# EAGLE design untitled (EAGLE 6.1)
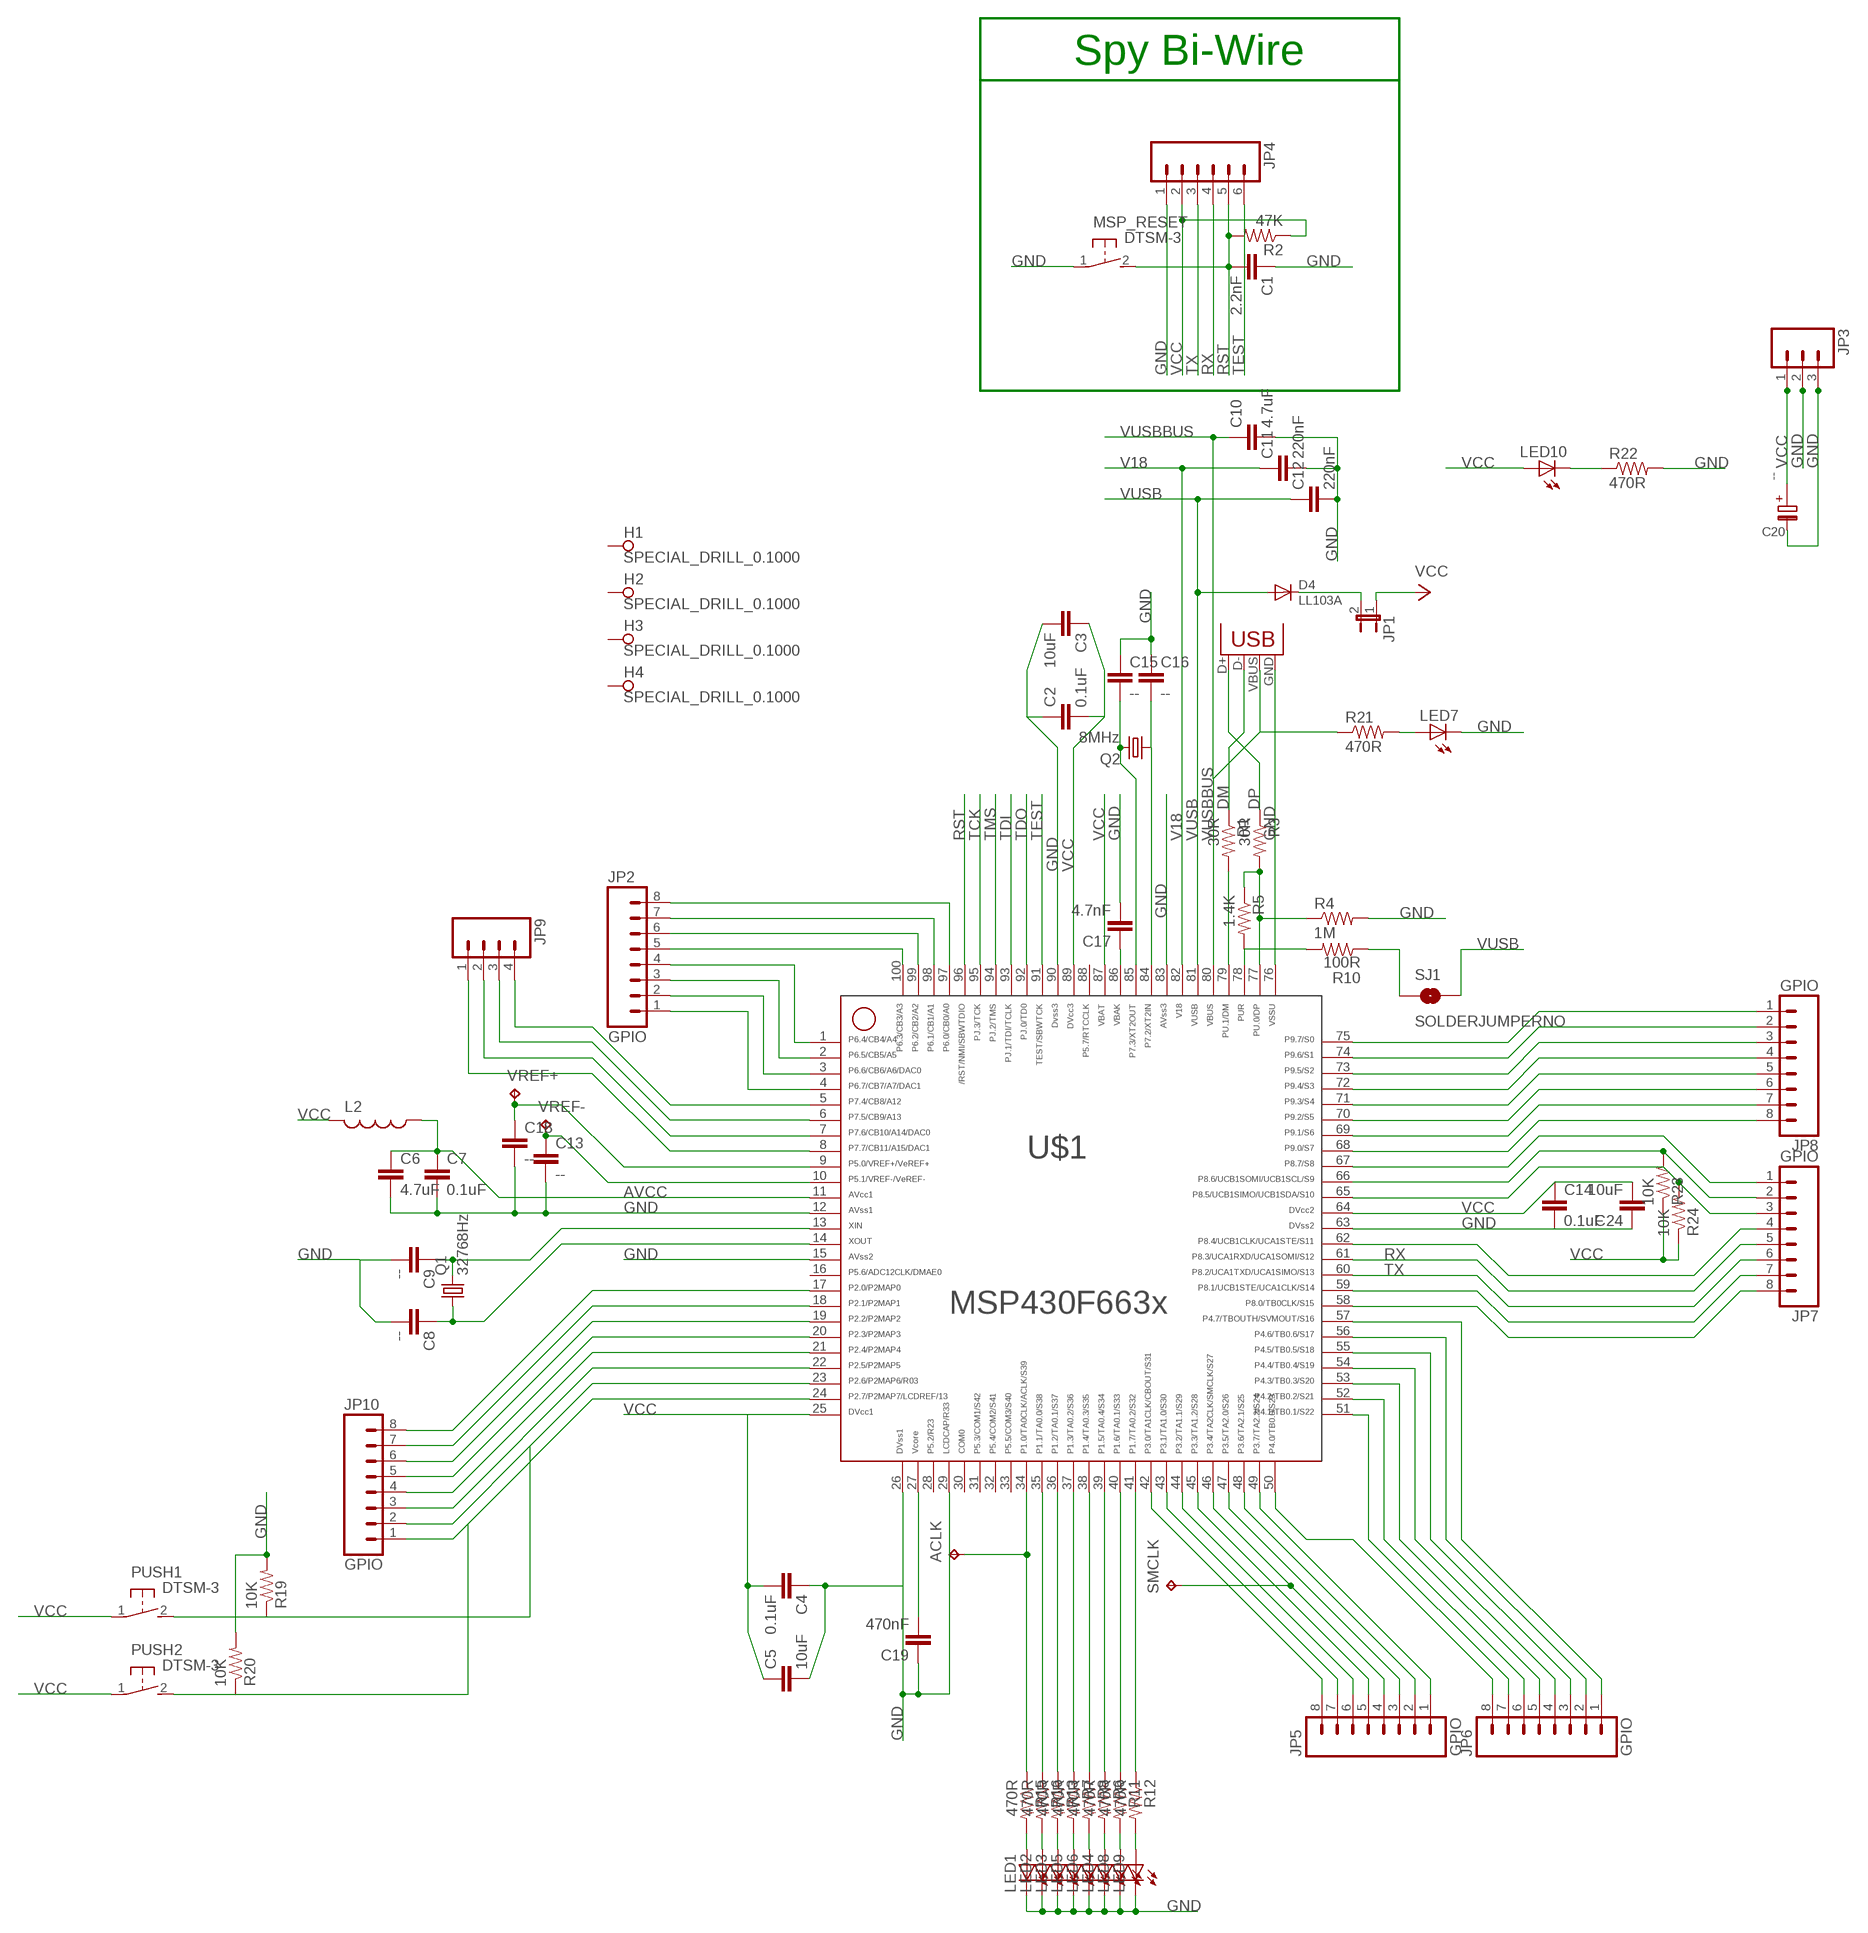
[diagram p0: schematic, sheet 1]

## Parts
ACLK  TPB1,27  [B1,27]
C1  2.2nF  CAP0805  [0805]
C2  0.1uF  CAP0805  [0805]
C3  10uF  CAP0805  [0805]
C4  0.1uF  CAP0805  [0805]
C5  10uF  CAP0805  [0805]
C6  4.7uF  CAP0805  [0805]
C7  0.1uF  CAP0805  [0805]
C8  --  CAP0805  [0805]
C9  --  CAP0805  [0805]
C10  4.7uF  CAP0805  [0805]
C11  220nF  CAP0805  [0805]
C12  220nF  CAP0805  [0805]
C13  --  CAP0805  [0805]
C14  0.1uF  CAP0805  [0805]
C15  --  CAP0805  [0805]
C16  --  CAP0805  [0805]
C17  4.7nF  CAP0805  [0805]
C18  --  CAP0805  [0805]
C19  470nF  CAP0805  [0805]
C20  --  ELKO_1210  [1210ELKO]
C24  10uF  CAP0805  [0805]
D4  LL103A  D  [SOD-80]
H1  SPECIAL_DRILL_0.1000  [PAD_0.1000]
H2  SPECIAL_DRILL_0.1000  [PAD_0.1000]
H3  SPECIAL_DRILL_0.1000  [PAD_0.1000]
H4  SPECIAL_DRILL_0.1000  [PAD_0.1000]
JP1  JP1E  [JP1]
JP2  GPIO  M08  [1X08]
JP3  M03PTH  [1X03]
JP4  M06SIP  [1X06]
JP5  GPIO  M08  [1X08]
JP6  GPIO  M08  [1X08]
JP7  GPIO  M08  [1X08]
JP8  GPIO  M08  [1X08]
JP9  M04PTH  [1X04]
JP10  GPIO  M08  [1X08]
L2  L-USL2012C  [L2012C]
LED1  LEDCHIPLED_0805  [CHIPLED_0805]
LED2  LEDCHIPLED_0805  [CHIPLED_0805]
LED3  LEDCHIPLED_0805  [CHIPLED_0805]
LED4  LEDCHIPLED_0805  [CHIPLED_0805]
LED5  LEDCHIPLED_0805  [CHIPLED_0805]
LED6  LEDCHIPLED_0805  [CHIPLED_0805]
LED7  LEDCHIPLED_0805  [CHIPLED_0805]
LED8  LEDCHIPLED_0805  [CHIPLED_0805]
LED9  LEDCHIPLED_0805  [CHIPLED_0805]
LED10  LEDCHIPLED_0805  [CHIPLED_0805]
MSP_RESET  DTSM-3  [DTSM-3]
PUSH1  DTSM-3  [DTSM-3]
PUSH2  DTSM-3  [DTSM-3]
Q1  32768Hz  CRYSTALTC26H  [TC26H]
Q2  8MHz  CRYSTALHC49U-V  [HC49U-V]
R1  30R  R-US_M0805  [M0805]
R2  47K  R-US_M0805  [M0805]
R3  30R  R-US_M0805  [M0805]
R4  1M  R-US_M0805  [M0805]
R5  1.4K  R-US_M0805  [M0805]
R6  470R  R-US_R0603  [R0603]
R7  470R  R-US_R0603  [R0603]
R8  470R  R-US_R0603  [R0603]
R10  100R  R-US_R0603  [R0603]
R11  470R  R-US_R0603  [R0603]
R12  470R  R-US_R0603  [R0603]
R13  470R  R-US_R0603  [R0603]
R15  470R  R-US_R0603  [R0603]
R16  470R  R-US_R0603  [R0603]
R19  10K  R-US_M0805  [M0805]
R20  10K  R-US_M0805  [M0805]
R21  470R  R-US_R0603  [R0603]
R22  470R  R-US_R0603  [R0603]
R23  10K  R-US_M0805  [M0805]
R24  10K  R-US_M0805  [M0805]
SJ1  SOLDERJUMPERNO  [SJ_2S-NO]
SMCLK  TPB1,27  [B1,27]
U$1  F66XX---PZ100  [PZ100]
VREF+  TPB1,27  [B1,27]
VREF-  TPB1,27  [B1,27]
X1  USBSMD  [USB-MINIB]

## Nets
AVCC: C6.1 C7.1 L2.1 U$1.11
DM: R1.1 X1.D-
DP: R3.1 X1.D+
GND [power]: C1.1 C2.1 C3.2 C4.1 C5.2 C6.2 C7.2 C8.2 C9.2 C10.2 C11.2 C12.2 C13.2 C14.2 C15.1 C16.1 C17.2 C18.2 C19.1 C20.- C24.1 JP3.2 JP3.3 JP4.1 LED1.C LED2.C LED3.C LED4.C LED5.C LED6.C LED7.C LED8.C LED9.C MSP_RESET.1 R4.2 R19.2 R20.2 R22.2 U$1.12 U$1.15 U$1.26 U$1.29 U$1.63 U$1.76 U$1.83 U$1.90 X1.GND
N$1: R1.2 U$1.79
N$3: R3.2 R4.1 R5.1 U$1.77
N$4: R5.2 R10.2 U$1.78
N$5: C9.1 Q1.2 U$1.13
N$6: C8.1 Q1.1 U$1.14
N$7: JP10.7 U$1.18
N$8: R10.1 SJ1.1
N$9: D4.2(K) JP1.2
N$11: R11.1 U$1.40
N$12: C13.1 U$1.10 VREF-.TP
N$13: LED2.A R16.2
N$14: C18.1 U$1.9 VREF+.TP
N$15: R12.1 U$1.41
N$16: C19.2 U$1.27
N$17: R6.1 U$1.39
N$18: R8.1 U$1.38
N$19: R7.1 U$1.37
N$20: JP2.5 U$1.100
N$21: R16.1 U$1.35
N$22: JP2.6 U$1.99
N$23: LED4.A R6.2
N$24: LED3.A R13.2
N$25: JP2.7 U$1.98
N$26: LED5.A R7.2
N$27: LED6.A R8.2
N$28: JP2.8 U$1.97
N$29: JP2.4 U$1.1
N$30: R13.1 U$1.36
N$31: JP2.3 U$1.2
N$32: LED1.A R15.2
N$33: JP2.2 U$1.3
N$34: LED8.A R11.2
N$35: LED7.A R21.2
N$36: ACLK.TP R15.1 U$1.34
N$37: JP10.6 U$1.19
N$38: LED9.A R12.2
N$39: JP2.1 U$1.4
N$40: JP9.4 U$1.5
N$41: JP9.3 U$1.6
N$42: JP9.2 U$1.7
N$43: JP9.1 U$1.8
N$44: JP5.8 U$1.42
N$45: JP5.7 U$1.43
N$46: JP5.6 U$1.44
N$47: JP5.5 U$1.45
N$48: JP5.4 SMCLK.TP U$1.46
N$49: JP5.3 U$1.47
N$50: JP5.2 U$1.48
N$51: JP5.1 U$1.49
N$52: JP6.8 U$1.50
N$53: JP6.7 U$1.51
N$54: JP6.6 U$1.52
N$55: JP6.5 U$1.53
N$56: JP6.4 U$1.54
N$57: JP6.3 U$1.55
N$58: JP6.2 U$1.56
N$59: JP6.1 U$1.57
N$60: C16.2 Q2.1 U$1.84
N$61: C15.2 Q2.2 U$1.85
N$62: C17.1 U$1.86
N$63: LED10.C R22.1
N$64: JP10.5 U$1.20
N$65: JP7.8 U$1.58
N$66: JP7.7 U$1.59
N$68: JP10.2 PUSH1.2 R19.1 U$1.23
N$69: JP7.4 U$1.62
N$70: JP7.3 R24.2 U$1.65
N$71: JP7.2 R23.2 U$1.66
N$72: JP7.1 U$1.67
N$74: JP8.8 U$1.68
N$75: JP8.7 U$1.69
N$76: JP8.6 U$1.70
N$77: JP8.5 U$1.71
N$80: JP10.1 PUSH2.2 R20.1 U$1.24
N$81: JP8.4 U$1.72
N$82: JP8.3 U$1.73
N$83: JP8.2 U$1.74
N$84: JP8.1 U$1.75
N$85: JP10.8 U$1.17
N$86: JP10.4 U$1.21
N$87: JP10.3 U$1.22
RST: C1.2 JP4.5 MSP_RESET.2 R2.2 U$1.96
RX: JP4.4 JP7.5 U$1.61
TCK: U$1.95
TDI: U$1.93
TDO: U$1.92
TEST: JP4.6 U$1.91
TMS: U$1.94
TX: JP4.3 JP7.6 U$1.60
V18: C11.1 U$1.82
VCC: C2.2 C3.1 C4.2 C5.1 C14.1 C20.+ C24.2 JP1.1 JP3.1 JP4.2 L2.2 LED10.A PUSH1.1 PUSH2.1 R2.1 R23.1 R24.1 U$1.25 U$1.64 U$1.87 U$1.89
VUSB: C12.1 D4.1(A) SJ1.2 U$1.81
VUSBBUS: C10.1 R21.1 U$1.80 X1.VBUS
Unconnected: H1.1 H2.1 H3.1 H4.1 U$1.16 U$1.28 U$1.30 U$1.31 U$1.32 U$1.33 U$1.88

## Notes on the sheet
- Spy Bi-Wire

## Library data of the parts
ACLK SMCLK VREF+ VREF- = testpad:TP: Test pad
C1-C19 C24 = SparkFun:CAP: Capacitor Standard 0603 ceramic capacitor, and 0.1" leaded capacitor.
C20 = smd:ELKO_1210
D4 = smd:D
H1-H4 = special-drill:SPECIAL_DRILL_: Special drills
JP1 = jumper:JP1E: JUMPER
JP2 JP5-JP8 JP10 = SparkFunv2:M08: Header 8 Standard 8-pin 0.1" header. Use with straight break away headers (SKU : PRT-00116), right angle break away headers (PRT-00553), swiss pins (PRT-00743), machine pins (PRT-00117), and female headers (PRT-00115).
JP3 = SparkFun:M03: Header 3 Standard 3-pin 0.1" header. Use with straight break away headers (SKU : PRT-00116), right angle break away headers (PRT-00553), swiss pins (PRT-00743), machine pins (PRT-00117), and female headers (PRT-00115). Molex polarized connector foot print use with SKU : PRT-08232 with associated crimp pins and housings.
JP4 = SparkFun:M06: Header 6 Standard 6-pin 0.1" header. Use with straight break away headers (SKU : PRT-00116), right angle break away headers (PRT-00553), swiss pins (PRT-00743), machine pins (PRT-00117), and female headers (PRT-00115). Molex polarized connector foot print use with SKU : PRT-08094 with associated crimp pins and housings. NOTES ON THE VARIANTS LOCK and LOCK_LONGPADS... This footprint was designed to help hold the alignment of a through-hole component (i.e. 6-pin header) while soldering it into place. You may notice that each hole has been shifted either up or down by 0.005 of an inch from it's more standard position (which is a perfectly straight line). This slight alteration caused the pins (the squares in the middle) to touch the edges of the holes. Because they are alternating, it causes a "brace" to hold the component in place. 0.005 has proven to be the perfect amount of "off-center" position when using our standard breakaway headers. Although looks a little odd when you look at the bare footprint, once you have a header in there, the alteration is very hard to notice. Also, if you push a header all the way into place, it is covered up entirely on the bottom side. This idea of altering the position of holes to aid alignment will be further integrated into the Sparkfun Library for other footprints. It can help hold any component with 3 or more connection pins.
JP9 = SparkFun:M04: Header 4 Standard 4-pin 0.1" header. Use with straight break away headers (SKU : PRT-00116), right angle break away headers (PRT-00553), swiss pins (PRT-00743), machine pins (PRT-00117), and female headers (PRT-00115). Molex polarized connector foot print use with SKU : PRT-08231 with associated crimp pins and housings. 1MM SMD Version SKU: PRT-10208
L2 = rcl:L-US: INDUCTOR, American symbol
LED1-LED10 = led:LED: LED OSRAM: - CHIPLED LG R971, LG N971, LY N971, LG Q971, LY Q971, LO R971, LY R971 LH N974, LH R974 LS Q976, LO Q976, LY Q976 LO Q996 - Hyper CHIPLED LW Q18S LB Q993, LB Q99A, LB R99A - SideLED LS A670, LO A670, LY A670, LG A670, LP A670 LB A673, LV A673, LT A673, LW A673 LH A674 LY A675 LS A676, LA A676, LO A676, LY A676, LW A676 LS A679, LY A679, LG A679 - Hyper Micro SIDELED® LS Y876, LA Y876, LO Y876, LY Y876 LT Y87S - SmartLED LW L88C, LW L88S LB L89C, LB L89S, LG L890 LS L89K, LO L89K, LY L89K LS L896, LA L896, LO L896, LY L896 - TOPLED LS T670, LO T670, LY T670, LG T670, LP T670 LSG T670, LSP T670, LSY T670, LOP T670, LYG T670 LG T671, LOG T671, LSG T671 LB T673, LV T673, LT T673, LW T673 LH T674 LS T676, LA T676, LO T676, LY T676, LB T676, LH T676, LSB T676, LW T676 LB T67C, LV T67C, LT T67C, LS T67K, LO T67K, LY T67K, LW E67C LS E67B, LA E67B, LO E67B, LY E67B, LB E67C, LV E67C, LT E67C LW T67C LS T679, LY T679, LG T679 LS T770, LO T770, LY T770, LG T770, LP T770 LB T773, LV T773, LT T773, LW T773 LH T774 LS E675, LA E675, LY E675, LS T675 LS T776, LA T776, LO T776, LY T776, LB T776 LHGB T686 LT T68C, LB T68C - Hyper Mini TOPLED® LB M676 - Mini TOPLED Santana® LG M470 LS M47K, LO M47K, LY M47K Source: http://www.osram.convergy.de LUXEON: - LUMILED® LXK2-PW12-R00, LXK2-PW12-S00, LXK2-PW14-U00, LXK2-PW14-V00 LXK2-PM12-R00, LXK2-PM12-S00, LXK2-PM14-U00 LXK2-PE12-Q00, LXK2-PE12-R00, LXK2-PE12-S00, LXK2-PE14-T00, LXK2-PE14-U00 LXK2-PB12-K00, LXK2-PB12-L00, LXK2-PB12-M00, LXK2-PB14-N00, LXK2-PB14-P00, LXK2-PB14-Q00 LXK2-PR12-L00, LXK2-PR12-M00, LXK2-PR14-Q00, LXK2-PR14-R00 LXK2-PD12-Q00, LXK2-PD12-R00, LXK2-PD12-S00 LXK2-PH12-R00, LXK2-PH12-S00 LXK2-PL12-P00, LXK2-PL12-Q00, LXK2-PL12-R00 Source: www.luxeon.com KINGBRIGHT: KA-3528ASYC Source: www.kingbright.com
MSP_RESET PUSH1 PUSH2 = switch-tact:DTSM-3
Q1 Q2 = crystal:CRYSTAL: CRYSTAL
R1-R5 R19 R20 R23 R24 = resistor:R-US_: RESISTOR, American symbol
R6-R8 R11-R13 R15 R16 R21 R22 = _MSP430:R-US_: RESISTOR, American symbol
R10 = rcl:R-US_: RESISTOR, American symbol
SJ1 = SparkFun:SOLDERJUMPER: Solder Jumper Standard SMD solder jumper. Used to automate production. Two varients : Normally Open and Normally Closed are the same, but have different paste layers. NC will have a large amount of paste and should jumper during reflow.
U$1 = TI_MSP430_v16:F66XX---PZ100: ***MSP430F66XX***PZ64 Rev 1.0 *** 06/2010
X1 = SparkFun:USB: USB Connectors USB-B-PTH is fully proven SKU : PRT-00139 USB-miniB is fully proven SKU : PRT-00587 USB-A-PCB is untested. USB-A-H is throughly reviewed, but untested. Spark Fun Electronics SKU : PRT-00437 USB-B-SMT is throughly reviewed, but untested. Needs silkscreen touching up. USB-A-S has not been used/tested USB-MB-H has not been used/tested

## Net classes
0 default: width 0.178 mm, drill 0.381 mm, clearance 0.178 mm
1 power: width 0.254 mm, drill 0.305 mm, clearance 0.152 mm

## Board
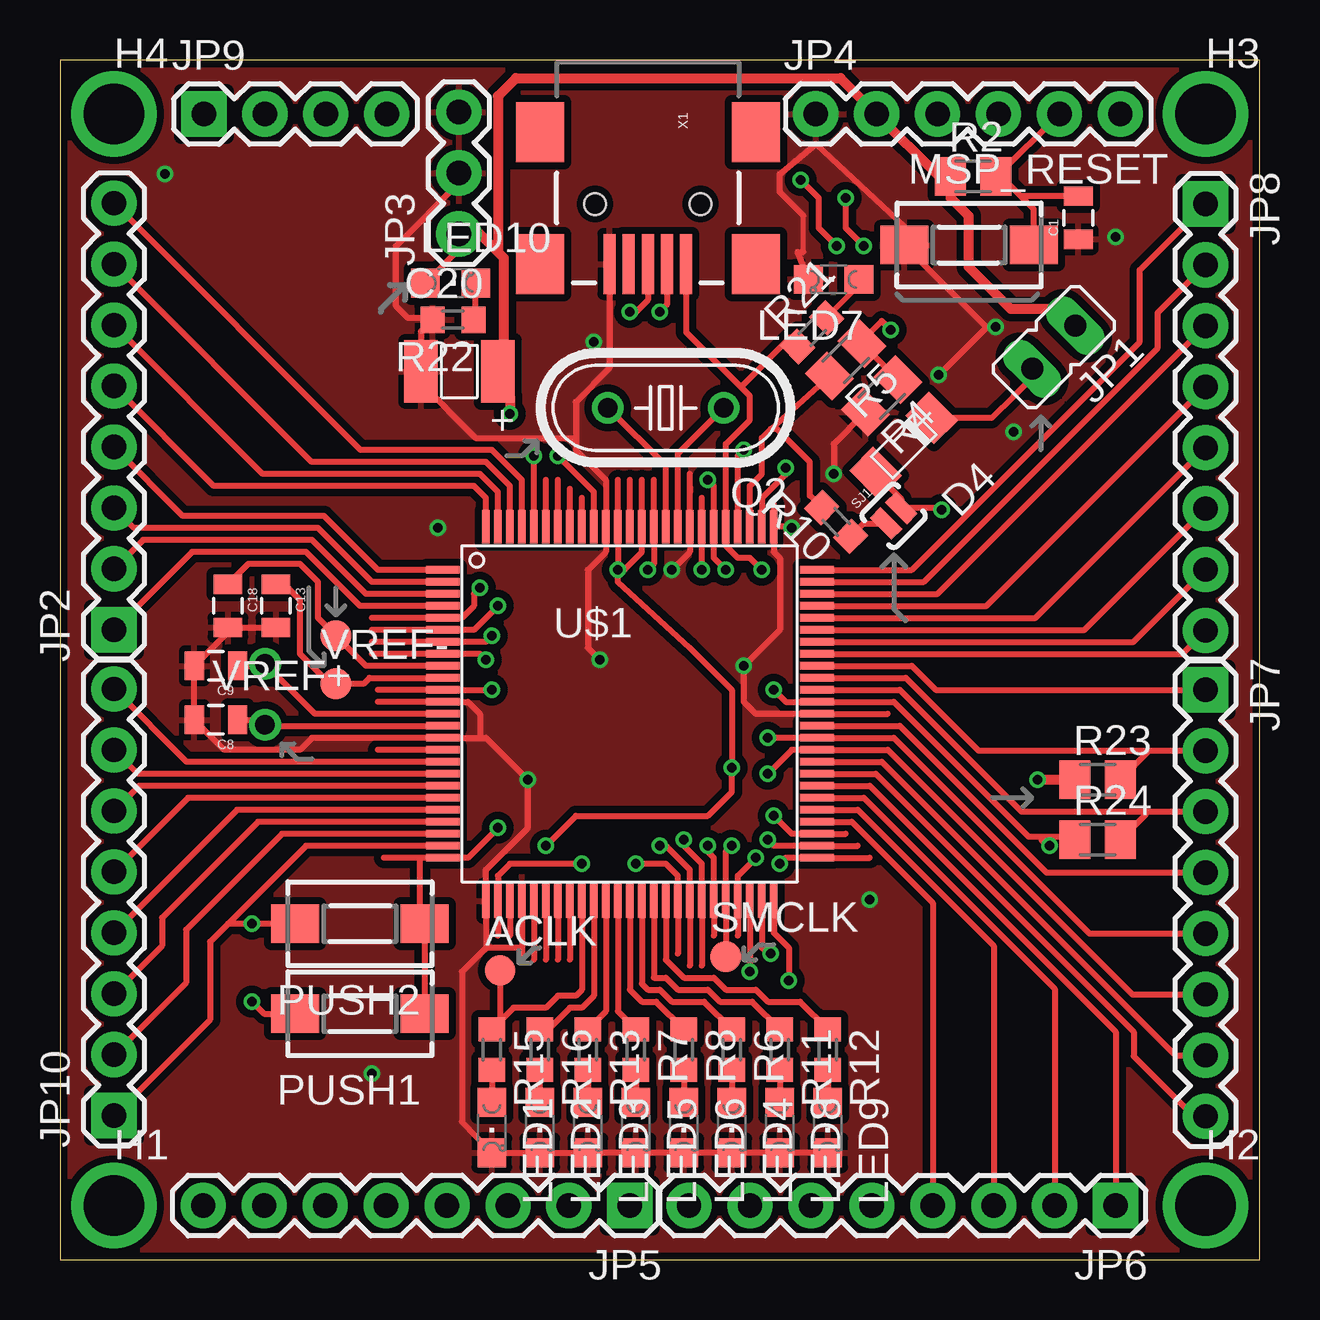
[diagram p1: board, top side]
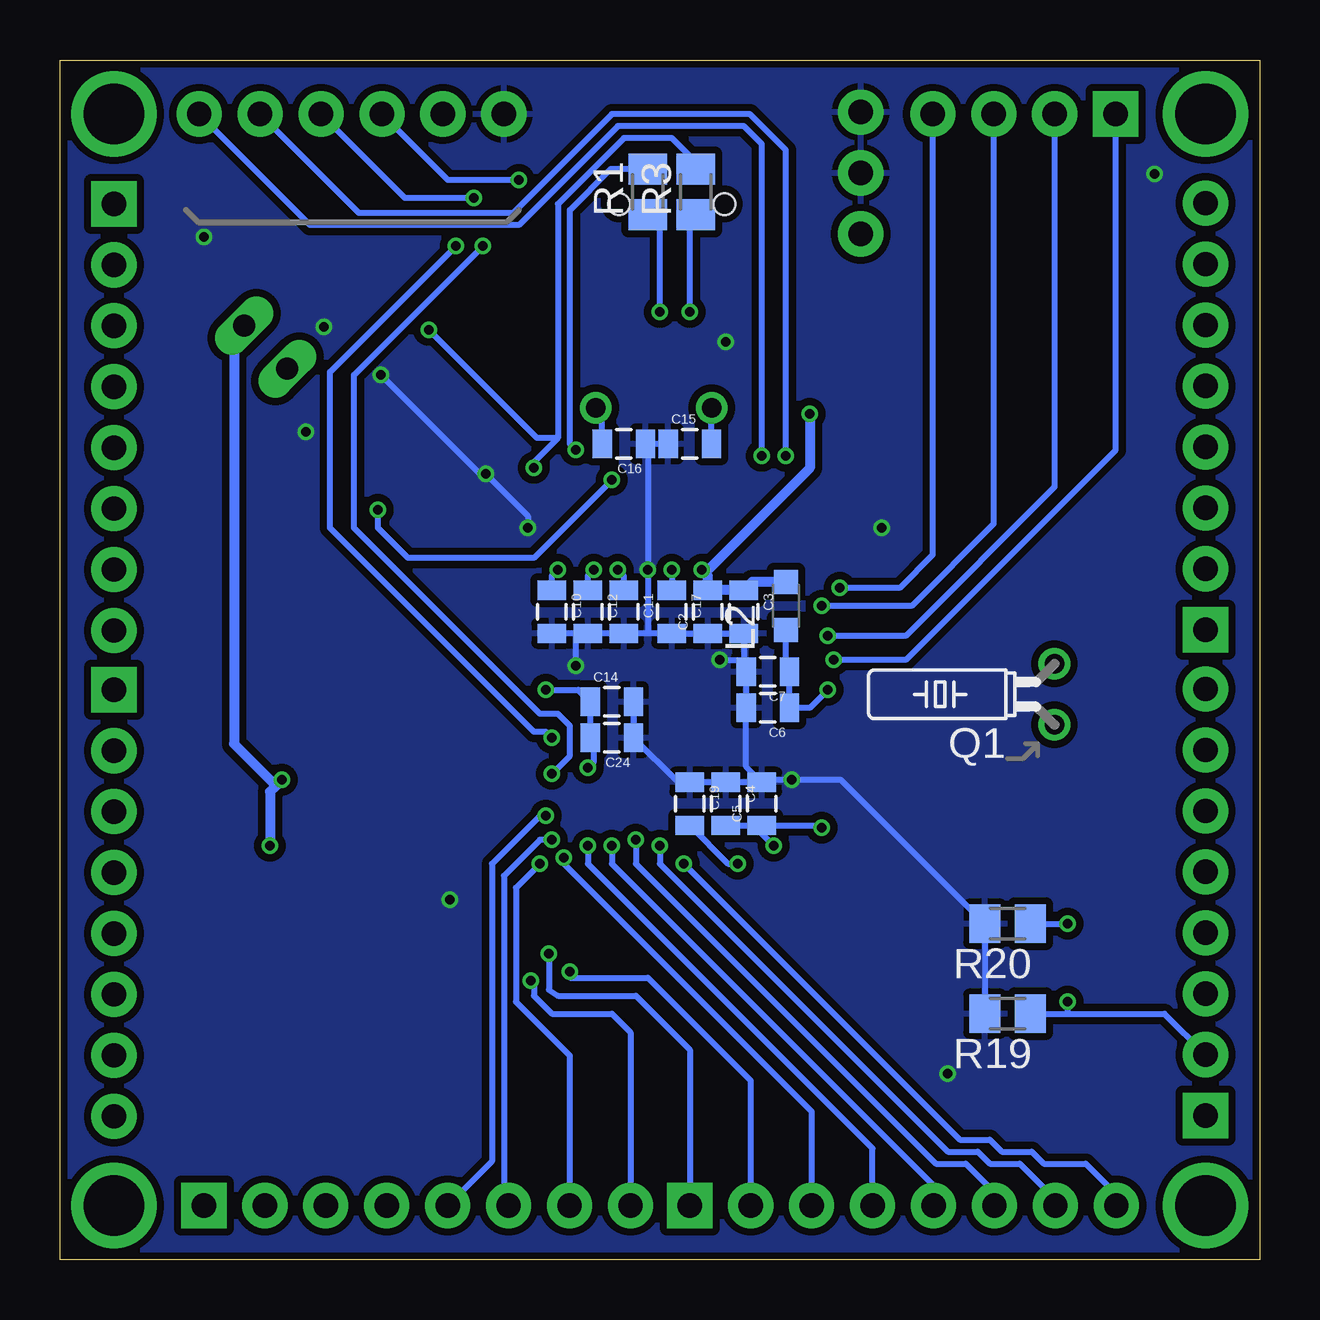
[diagram p2: board, bottom side, seen from below]

Size 50 x 50 mm. Coordinates in mm from the lower left corner, seen from the top.
Outline: 0,0 50,0 50,50 0,50 0,0
Copper layers (1*16): Top 0.035mm / dielectric 1.5mm / Bottom 0.035mm
Design rules: minimum track width 6mil, minimum drill 12mil, track to track 6mil, track to pad 6mil, pad to pad 6mil, via to via 6mil, smd to smd 0mil, copper to edge 10mil, drill to drill 10mil, minimum pad ring 10mil, minimum via ring 6mil, stop-mask expansion 2mil, vias tented up to drill 100mil, thermal gap 10mil

### Footprints (pad centres in the part's own frame; a part is rotated, then mirrored left to right if it is on the bottom)
B1,27 = smd 1.27 x 1.27: TP 0,0
0805 = smd 0.8 x 1.2: 1 -0.9,0; 2 0.9,0
1210ELKO = smd 1.397 x 2.591: + 1.6,0; - -1.6,0
SOD-80 = smd 1.397 x 1.702: 1 1.397,-0.025; 2 -1.88,0
PAD_0.1000 = drill 2.54 pad 2.54: 1 0,0
JP1 = drill 0.914 long: 1 0,-1.27; 2 0,1.27
1X08 = drill 1.016 pad 1.88 square: 1 0,0 | drill 1.016 pad 1.88: 2 2.54,0; 3 5.08,0; 4 7.62,0; 5 10.16,0; 6 12.7,0; 7 15.24,0; 8 17.78,0
1X03 = drill 1.016 pad 1.88: 1 0,0; 2 2.54,0; 3 5.08,0
1X06 = drill 1.016 pad 1.88: 1 0,0; 2 2.54,0; 3 5.08,0; 4 7.62,0; 5 10.16,0; 6 12.7,0
1X04 = drill 1.016 pad 1.88 square: 1 0,0 | drill 1.016 pad 1.88: 2 2.54,0; 3 5.08,0; 4 7.62,0
L2012C = smd 1 x 1: 1 -1,0; 2 1,0
CHIPLED_0805 = smd 1.2 x 1.2: A 0,-1.05; C 0,1.05
DTSM-3 = smd 2 x 1.6: 1 -2.7,0; 2 2.7,0
TC26H = drill 0.813: 1 -1.27,0; 2 1.27,0
HC49U-V = drill 0.813: 1 -2.413,0; 2 2.413,0
M0805 = smd 1.3 x 1.6: 1 -0.95,0; 2 0.95,0
R0603 = smd 1 x 1.1: 1 -0.85,0; 2 0.85,0
SJ_2S-NO = smd 0.635 x 1.27: 1 -0.45,0; 2 0.45,0
PZ100 = smd 1.4 x 0.3: 1 -7.8,6; 2 -7.8,5.5; 3 -7.8,5; 4 -7.8,4.5; 5 -7.8,4; 6 -7.8,3.5; 7 -7.8,3; 8 -7.8,2.5; 9 -7.8,2; 10 -7.8,1.5; 11 -7.8,1; 12 -7.8,0.5; 13 -7.8,0; 14 -7.8,-0.5; 15 -7.8,-1; 16 -7.8,-1.5; 17 -7.8,-2; 18 -7.8,-2.5; 19 -7.8,-3; 20 -7.8,-3.5; 21 -7.8,-4; 22 -7.8,-4.5; 23 -7.8,-5; 24 -7.8,-5.5; 25 -7.8,-6; 51 7.8,-6; 52 7.8,-5.5; 53 7.8,-5; 54 7.8,-4.5; 55 7.8,-4; 56 7.8,-3.5; 57 7.8,-3; 58 7.8,-2.5; 59 7.8,-2; 60 7.8,-1.5; 61 7.8,-1; 62 7.8,-0.5; 63 7.8,0; 64 7.8,0.5; 65 7.8,1; 66 7.8,1.5; 67 7.8,2; 68 7.8,2.5; 69 7.8,3; 70 7.8,3.5; 71 7.8,4; 72 7.8,4.5; 73 7.8,5; 74 7.8,5.5; 75 7.8,6 | smd 0.3 x 1.4: 26 -6,-7.8; 27 -5.5,-7.8; 28 -5,-7.8; 29 -4.5,-7.8; 30 -4,-7.8; 31 -3.5,-7.8; 32 -3,-7.8; 33 -2.5,-7.8; 34 -2,-7.8; 35 -1.5,-7.8; 36 -1,-7.8; 37 -0.5,-7.8; 38 0,-7.8; 39 0.5,-7.8; 40 1,-7.8; 41 1.5,-7.8; 42 2,-7.8; 43 2.5,-7.8; 44 3,-7.8; 45 3.5,-7.8; 46 4,-7.8; 47 4.5,-7.8; 48 5,-7.8; 49 5.5,-7.8; 50 6,-7.8; 76 6,7.8; 77 5.5,7.8; 78 5,7.8; 79 4.5,7.8; 80 4,7.8; 81 3.5,7.8; 82 3,7.8; 83 2.5,7.8; 84 2,7.8; 85 1.5,7.8; 86 1,7.8; 87 0.5,7.8; 88 0,7.8; 89 -0.5,7.8; 90 -1,7.8; 91 -1.5,7.8; 92 -2,7.8; 93 -2.5,7.8; 94 -3,7.8; 95 -3.5,7.8; 96 -4,7.8; 97 -4.5,7.8; 98 -5,7.8; 99 -5.5,7.8; 100 -6,7.8
USB-MINIB = smd 2.5 x 0.5: D+ 2.5,0; D- 2.5,0.8; GND 2.5,-1.6; ID 2.5,-0.8; VBUS 2.5,1.6 | smd 2.5 x 2: MTN1 -3,4.5; MTN2 2.5,4.5; MTN3 -3,-4.5; MTN4 2.5,-4.5 | hole 0.9: 0,2.2; 0,-2.2

### Placement (x,y rotation side)
ACLK  18.35,12.05 0 top
C1  42.45,43.42 90 top
C2  23,27 90 bottom
C3  21.5,27 270 bottom
C4  22.25,19 270 bottom
C5  20.75,19 90 bottom
C6  20.5,23 180 bottom
C7  20.5,24.5 180 bottom
C8  6.5,22.5 180 top
C9  6.5,24.75 180 top
C10  29.5,27 270 bottom
C11  26.5,27 270 bottom
C12  28,27 270 bottom
C13  9,27.25 270 top
C14  27,23.25 0 bottom
C15  23.75,34 0 bottom
C16  26.5,34 180 bottom
C17  24.5,27 270 bottom
C18  7,27.25 270 top
C19  23.75,19 270 bottom
C20  16.65,37.02 0 top
C24  27,21.75 180 bottom
D4  35,33.75 225 top
H1  2.25,2.25 0 top
H2  47.75,2.25 0 top
H3  47.75,47.75 0 top
H4  2.25,47.75 0 top
JP1  41.42,38.03 135 top
JP2  2.25,26.25 90 top
JP3  16.62,42.75 90 top
JP4  31.5,47.75 0 top
JP5  23.75,2.25 180 top
JP6  44,2.25 180 top
JP7  47.75,23.75 270 top
JP8  47.75,44 270 top
JP9  6,47.75 0 top
JP10  2.25,6 90 top
L2  19.75,27.25 90 bottom
LED1  18,5.5 180 top
LED2  20,5.5 180 top
LED3  22,5.5 180 top
LED4  28,5.5 180 top
LED5  24,5.5 180 top
LED6  26,5.5 180 top
LED7  32.25,40.85 90 top
LED8  30,5.5 180 top
LED9  32,5.5 180 top
LED10  16.28,40.7 270 top
MSP_RESET  37.89,42.29 0 top
PUSH1  12.5,10.25 180 top
PUSH2  12.5,14 180 top
Q1  8.55,23.56 90 bottom
Q2  25.25,35.5 180 top
R1  25.5,44.5 90 bottom
R2  38.06,45.15 0 top
R3  23.5,44.5 90 bottom
R4  34.25,36 225 top
R5  32.75,37.5 225 top
R6  28,8.75 270 top
R7  24,8.75 270 top
R8  26,8.75 270 top
R10  32.35,30.74 135 top
R11  30,8.75 270 top
R12  32,8.75 270 top
R13  22,8.75 270 top
R15  18,8.75 270 top
R16  20,8.75 270 top
R19  10.5,10.25 180 bottom
R20  10.5,14 180 bottom
R21  31.35,38.66 45 top
R22  16.38,39.17 180 top
R23  43.25,20 0 top
R24  43.25,17.5 0 top
SJ1  34.75,31 45 top
SMCLK  27.75,12.62 0 top
U$1  23.75,22.75 0 top
VREF+  11.5,26 180 top
VREF-  11.5,24 0 top
X1  24.5,44 270 top

### Tracks (layer width: path | path; a pad name or v marks a point on that pad's centre or on a via)
AVCC  (via drill 0.4)
  Top 0.254: U$1.11 v18,23.75
  Bottom 0.254: v18,23.75 18.75,23 C6.1 C7.1 19.75,24.65 L2.1
DM  (via drill 0.4)
  Top 0.254: X1.D- 25.3,39.8 v25,39.5
  Bottom 0.254: v25,39.5 25,43.05 R1.1
DP  (via drill 0.4)
  Top 0.254: X1.D+ 24.5,40 24,39.5 v23.75,39.5
  Bottom 0.254: v23.75,39.5 23.75,43.3 R3.1
GND  (via drill 0.4)
  Top 0.2: 30.99,42 30.99,43.49 31,43.5 30.99,43.51
  Top 0.254: LED9.C LED8.C LED4.C LED6.C LED5.C LED3.C LED2.C LED1.C 16.75,5.75 16.75,12 17.75,13 | 34.5,22.75 U$1.63 29,22.75 28.5,23.25 v28.5,24.75 30,26.25 30,29.25 29.75,29.5 U$1.76 30.45,30.55 v30.5,30.5 | C13.2 C18.2 7,26.15 C9.2 C8.2 6.85,21.25 10,21.25 10.5,21.75 U$1.15 17.5,21.75 | v25.5,28.75 26.25,29.5 U$1.83 26.25,32.75 | 17.5,21.75 17.75,21.75 v19.5,20 19.5,18 17.75,16.25 U$1.26 17.75,13 | U$1.12 17,23.25 17.5,22.75 17.5,21.75 | v22.5,25 22,25.5 22,28.75 22.75,29.5 U$1.90 22.75,32.5 21.5,33.75 21.5,34.25 | X1.GND 22.9,37.15 21.5,35.75 21.5,34.25 | R4.2 32.25,34 v32.25,32.75 | 21.5,34.25 17.32,34.25 15,36.57 15,37 C20.- 15.05,38.69 R22.2 15.45,39.25 14.5,39.25 14,39.75 14,42.25 16.66,44.91 | LED7.C 30.75,42 30.99,42 | 30.99,43.51 30,44.5 30,45.25 31.5,46.5 35.19,43.06 MSP_RESET.1 38.6,38.88 38.62,38.88 v36.62,36.88 | U$1.29 19.25,13 17.75,13
  Bottom 0.254: C17.2 C2.1 C3.2 21.5,25 | 21.5,25 21.5,24.6 C7.2 C6.2 21.4,20.55 C5.2 | C17.2 C11.2 C12.2 28.5,26.1 | 28.5,26.1 C10.2 | C17.2 25.5,26.1 v25.5,28.75 25.5,33.9 C16.1 C15.1 | C14.2 C24.1 24.25,19.9 C19.1 C4.1 C5.2 | C5.2 20.65,20 v19.5,20 17.45,20 R20.2 R19.2 | v28.5,24.75 28.5,26.1 | v22.5,25 21.5,25 | v30.5,30.5 30.5,31 v32.25,32.75 32.5,32.75 v36.62,36.88
  other vias: 13,7.75 33.75,15 15.75,30.5 22.25,38.25 39.75,34.5 44,42.62 39,38.88 4.38,45.25
  pour Top (isolate 0.305): -1.25,52.38 -1.5,-1.25 52,-1.25 52.38,51.88
  pour Bottom (isolate 0.305): -4.12,51.62 -3.75,-1.5 53.25,-1.5 52.5,51.75
N$1  (via drill 0.4)
  Top 0.254: U$1.79 28.25,33.5 v28.5,33.75
  Bottom 0.254: R1.2 27.05,45.45 28.75,43.75 28.75,34 v28.5,33.75
N$2
  Top 0.254: 26.25,14.75 26.25,12.25
N$3  (via drill 0.4)
  Top 0.254: v30.25,33 30.25,32.75 29.25,31.75 U$1.77 | R4.1 R5.1 33.42,38.3 34.25,39.12 v34.62,38.75
  Bottom 0.254: R3.2 23.5,45.75 24.5,46.75 26.5,46.75 29.25,44 29.25,34.25 | 29.25,34.25 30.25,33.25 v30.25,33 | 29.25,34.25 30.12,34.25 v34.62,38.75
N$4
  Top 0.254: U$1.78 28.75,32.25 29.25,32.75 29.25,34.25 29.62,34.62 | R5.2 29.62,34.62 | 29.62,34.62 29.88,34.62 31.25,33.25 31.25,31.84 R10.2
N$5
  Top 0.254: C9.1 8.47,24.75 Q1.2 10.63,22.75 U$1.13
N$6
  Top 0.254: C8.1 8.47,22.5 8.55,22.42 Q1.1 8.59,22.25 U$1.14
N$7
  Top 0.254: U$1.18 3.24,20.25 JP10.7
N$8
  Top 0.254: R10.1 33.49,30.68 SJ1.1
N$9
  Top 0.254: JP1.2 40.62,36.85 39.75,36 38.83,35.08 D4.2
N$10
  Top 0.254: 31.75,17.75 32.75,17.75
N$11
  Top 0.254: U$1.40 24.75,11.75 25.25,11.75 25.75,11.25 27,11.25 27.5,10.75 28.85,10.75 R11.1
N$12
  Top 0.254: U$1.10 12.9,24.25 12.65,24 VREF-.TP 11.25,24 10,25.25 10,27.5 9.25,28.25 9,28.25 C13.1
N$13
  Top 0.254: LED2.A R16.2
N$14
  Top 0.254: U$1.9 12.75,24.75 VREF+.TP 10.75,26.75 10.75,28.25 10,29 7.85,29 C18.1
N$15
  Top 0.254: U$1.41 25.25,12.5 26,11.75 27.25,11.75 27.75,11.25 29,11.25 29.5,10.75 30.85,10.75 R12.1
N$16  (via drill 0.4)
  Top 0.254: v21.75,16.5 18.75,16.5 18.25,16 U$1.27
  Bottom 0.254: C19.2 22.15,16.5 v21.75,16.5
N$17
  Top 0.254: U$1.39 24.25,11.5 24.5,11.25 25,11.25 25.5,10.75 26.85,10.75 R6.1
N$18
  Top 0.254: U$1.38 23.75,11.25 24.25,10.75 24.85,10.75 R8.1
N$19
  Top 0.254: U$1.37 23.25,10.35 R7.1
N$20
  Top 0.254: U$1.100 17.75,31.75 17.25,32.25 6.41,32.25 JP2.5
N$21
  Top 0.254: U$1.35 22.25,11 21.75,10.5 21.25,10.5 20,9.25 R16.1
N$22
  Top 0.254: U$1.99 18.25,32 17.5,32.75 8.45,32.75 JP2.6
N$23
  Top 0.254: R6.2 LED4.A
N$24
  Top 0.254: R13.2 LED3.A
N$25
  Top 0.254: U$1.98 18.75,32.25 17.75,33.25 10.49,33.25 JP2.7
N$26
  Top 0.254: R7.2 LED5.A
N$27
  Top 0.254: R8.2 LED6.A
N$28
  Top 0.254: U$1.97 19.25,32.5 18,33.75 12.53,33.75 JP2.8
N$29
  Top 0.254: U$1.1 13.25,28.75 11,31 5.12,31 JP2.4
N$30
  Top 0.254: U$1.36 22.75,10.35 R13.1
N$31
  Top 0.254: U$1.2 13,28.25 10.75,30.5 3.08,30.5 JP2.3
N$32
  Top 0.254: R15.2 LED1.A
N$33
  Top 0.254: U$1.3 12.75,27.75 10.5,30 3.46,30 JP2.2
N$34
  Top 0.254: R11.2 LED8.A
N$35
  Top 0.2: LED7.A 33.3,40.6 R21.2
N$36
  Top 0.254: U$1.34 21.75,11.25 21.5,11 20.75,11 20.25,10.5 18.9,10.5 R15.1 18.35,9.95 ACLK.TP
N$37
  Top 0.254: U$1.19 3.3,19.75 JP10.6
N$38
  Top 0.254: R12.2 LED9.A
N$39
  Top 0.254: U$1.4 12.5,27.25 10.25,29.5 5.5,29.5 JP2.1
N$40  (via drill 0.4)
  Top 0.254: 13,26.75 U$1.5 16.75,26.75 17.25,27.25 17.25,27.75 v17.5,28
  Bottom 0.254: JP9.4 13.62,29.38 15,28 v17.5,28
N$41  (via drill 0.4)
  Top 0.254: 13,26.25 U$1.6 17.25,26.25 v18.25,27.25
  Bottom 0.254: JP9.3 11.08,30.67 14.5,27.25 v18.25,27.25
N$42  (via drill 0.4)
  Top 0.254: 13,25.75 U$1.7 17.75,25.75 v18,26
  Bottom 0.254: JP9.2 8.54,32.21 14.75,26 v18,26
N$43  (via drill 0.4)
  Top 0.254: 13,25.25 U$1.8 17.5,25.25 v17.75,25
  Bottom 0.254: JP9.1 6,33.75 14.75,25 v17.75,25
N$44  (via drill 0.4)
  Top 0.254: v24,16.5 25.25,16.5 25.75,16 U$1.42 25.75,12.75
  Bottom 0.254: v24,16.5 12.5,5 11.25,5 10.75,4.5 9.5,4.5 9,4 7.25,4 5.97,2.72 JP5.8
N$45  (via drill 0.4)
  Top 0.254: U$1.43 26.25,16.25 25.25,17.25 v25,17.25
  Bottom 0.254: v25,17.25 25,16.5 13,4.5 11.75,4.5 11.25,4 10,4 8.51,2.51 JP5.7
N$46  (via drill 0.4)
  Top 0.254: U$1.44 26.75,16.5 26,17.25 v26,17.5
  Bottom 0.254: v26,17.5 26,16.5 13.5,4 12.25,4 11.05,2.8 JP5.6
N$47  (via drill 0.4)
  Top 0.254: U$1.45 27.25,16.75 27,17 v27,17.25
  Bottom 0.254: v27,17.25 27,16.5 13.59,3.09 JP5.5
N$48  (via drill 0.4)
  Top 0.254: v28,17.25 27.75,17 U$1.46 SMCLK.TP
  Bottom 0.254: v28,17.25 28,16.5 16.13,4.63 JP5.4
N$49  (via drill 0.4)
  Top 0.254: U$1.47 28.25,16 v29,16.75
  Bottom 0.254: v29,16.75 29,16.5 18.67,6.17 JP5.3
N$50  (via drill 0.4)
  Top 0.254: U$1.48 v28.75,12
  Bottom 0.254: v28.75,12 28.75,11.75 25.5,11.75 21.21,7.46 JP5.2
N$51  (via drill 0.4)
  Top 0.254: U$1.49 29.25,13 v29.62,12.75
  Bottom 0.254: v29.62,12.75 29.62,11.25 29.25,11 26,11 23.75,8.75 JP5.1
N$52  (via drill 0.4)
  Top 0.254: U$1.50 29.75,13.62 30.38,13 v30.38,11.62
  Bottom 0.254: v30.38,11.62 30.25,11.62 30.25,11 29.5,10.25 27,10.25 26.22,9.47 JP6.8
N$53  (via drill 0.4)
  Top 0.254: U$1.51 30.25,16.75 v30,16.5
  Bottom 0.254: v30,16.5 31,15.5 31,10.75 28.76,8.51 JP6.7
N$54  (via drill 0.4)
  Top 0.254: U$1.52 29.75,17.25 v29.5,17.5
  Bottom 0.254: v29.5,17.5 30,17.5 31.5,16 31.5,2.45 JP6.6
N$55  (via drill 0.4)
  Top 0.254: U$1.53 30.5,17.75 v29.75,18.5
  Bottom 0.254: v29.75,18.5 30,18.5 32,16.5 32,4.09 JP6.5
N$56
  Top 0.254: U$1.54 33,18.25 36.38,14.87 JP6.4
N$57
  Top 0.254: U$1.55 33.25,18.75 38.92,13.08 JP6.3
N$58
  Top 0.254: U$1.56 33.5,19.25 41.46,11.29 JP6.2
N$59
  Top 0.254: U$1.57 33.75,19.75 44,9.5 JP6.1
N$60
  Top 0.254: U$1.84 25.75,33.59 Q2.1
  Bottom 0.254: C16.2 27.4,35.24 Q2.1
N$61
  Top 0.254: U$1.85 25.25,33.09 Q2.2
  Bottom 0.254: C15.2 22.85,35.49 Q2.2
N$62  (via drill 0.4)
  Top 0.254: U$1.86 24.75,29 v24.5,28.75
  Bottom 0.254: v24.5,28.75 C17.1
N$63
  Top 0.254: R22.1 17.33,39.27 LED10.C
N$64
  Top 0.254: U$1.20 5.34,19.25 JP10.5
N$65
  Top 0.254: U$1.58 34,20.25 44.75,9.5 44.75,8.47 47.25,5.97 JP7.8
N$66
  Top 0.254: U$1.59 34.25,20.75 46.49,8.51 JP7.7
N$67
  Top 0.254: 29.75,30.75 29.75,31.5
N$68  (via drill 0.4)
  Top 0.254: U$1.23 9.25,17.75 5.25,13.75 5.25,11.54 JP10.2 | v8,10.75 8.5,10.25 PUSH1.2
  Bottom 0.254: 8,10.25 3.96,10.25 JP10.2 | R19.1 8,10.25 | 8,10.25 v8,10.75
N$69
  Top 0.254: U$1.62 35,22.25 41.12,16.13 JP7.4
N$70
  Top 0.254: U$1.65 35,23.75 40.08,18.67 45.25,18.67 | 45.25,18.67 JP7.3 | R24.2 45.25,18.55 45.25,18.67
N$71
  Top 0.254: U$1.66 35.25,24.25 38.29,21.21 45.41,21.21 | 45.41,21.21 JP7.2 | R23.2 45.41,21.21
N$72
  Top 0.254: U$1.67 35.5,24.75 36.5,23.75 JP7.1 47.5,23.75
N$73
  Top 0.254: 26.75,14.75 26.75,12.25
N$74
  Top 0.254: U$1.68 46.78,25.25 JP8.8
N$75
  Top 0.254: U$1.69 44.74,25.75 JP8.7
N$76
  Top 0.254: U$1.70 42.7,26.25 JP8.6
N$77
  Top 0.254: U$1.71 40.66,26.75 JP8.5
N$78
  Top 0.254: 27.25,14.75 27.25,13.5
N$79
  Top 0.254: 28.25,14.75 28.25,13.5
N$80  (via drill 0.4)
  Top 0.254: 9.55,13.75 PUSH2.2 v8,14 7,14 | U$1.24 10.25,17.25 7,14 | 7,14 6.25,13.25 6.25,10 JP10.1
  Bottom 0.254: R20.1 v8,14
N$81
  Top 0.254: U$1.72 38.62,27.25 JP8.4
N$82
  Top 0.254: U$1.73 36.58,27.75 JP8.3
N$83
  Top 0.254: U$1.74 36,28.25 45.75,38 45.75,39.46 JP8.2
N$84
  Top 0.254: U$1.75 35.5,28.75 45,38.25 45,41.25 JP8.1
N$85
  Top 0.254: U$1.17 5.28,20.75 JP10.8
N$86
  Top 0.254: U$1.21 7.38,18.75 JP10.4
N$87
  Top 0.254: U$1.22 8.25,18.25 4.25,14.25 4.25,13.08 JP10.3
N$88
  Top 0.254: 31.75,17.25 33.25,17.25
N$89
  Top 0.254: 31.75,16.75 33.75,16.75
N$90
  Top 0.254: 20.25,30.75 20.25,32.5
N$91
  Top 0.254: 20.75,30.75 20.75,32.5
N$92
  Top 0.254: 21.25,30.75 21.25,32.12
N$93
  Top 0.254: 21.75,30.5 21.75,31.38 21.75,31.5 21.75,31.75
N$94
  Top 0.254: 23.25,30.75 23.25,32.5
N$95
  Top 0.254: 23.75,30.75 23.75,32.5
N$96
  Top 0.254: 24.25,30.75 24.25,32.5
N$97
  Top 0.254: 24.75,31 24.75,32.5
N$98
  Top 0.254: 26.75,31 26.75,31.75
N$99
  Top 0.254: 15.75,23.75 13.25,23.75
N$100
  Top 0.254: 15.75,23.25 13.25,23.25
N$101
  Top 0.254: 15.75,21.25 13.25,21.25
N$102
  Top 0.254: 18.25,14.75 18.25,13.5
N$103
  Top 0.254: 18.75,14.75 18.75,13.5
N$104
  Top 0.254: 19.25,14.75 19.25,12.5
N$105
  Top 0.254: 19.75,14.75 19.75,12.5
N$106
  Top 0.254: 20.25,14.75 20.25,12.5
N$107
  Top 0.254: 20.75,14.5 20.75,12.5
N$108
  Top 0.254: 21.25,14.5 21.25,12.5
RST  (via drill 0.4)
  Top 0.2: 39.31,45.2 R2.2
  Top 0.254: U$1.96 v19.75,33.5 | MSP_RESET.2 40.59,43.78 40.05,44.33 | 41.67,47.73 JP4.5 39.06,45.15 R2.2 39.04,45.12 39.25,45.12 40.05,44.33 | C1.2 40.05,44.33
  Bottom 0.254: v19.75,33.5 19.75,46.25 21.25,47.75 27,47.75 31.12,43.62 37.53,43.62 JP4.5
RX  (via drill 0.4)
  Top 0.254: JP7.5 42.91,13.59 34.75,21.75 U$1.61 v29.5,21.75 | v33.5,42.25 32.75,43 v32.75,44.25
  Bottom 0.254: v29.5,21.75 29.75,22 30.25,22 38.75,30.5 38.75,37 v33.5,42.25 | v32.75,44.25 35.62,44.25 JP4.4
TEST  (via drill 0.4)
  Top 0.254: U$1.91 22.25,32 v20.75,33.5
  Bottom 0.254: v20.75,33.5 20.75,46.5 21.5,47.25 26.75,47.25 30.88,43.12 39.58,43.12 JP4.6
TX  (via drill 0.4)
  Top 0.254: JP7.6 44.7,11.05 34.5,21.25 U$1.60 30.5,21.25 v29.5,20.25 | v32.38,42.25 31.62,43 31.62,44.25 v30.88,45
  Bottom 0.254: v29.5,20.25 28.75,21 28.75,22.25 29.25,22.75 30,22.75 37.75,30.5 37.75,36.88 v32.38,42.25 | v30.88,45 33.83,45 JP4.3
V18  (via drill 0.4)
  Top 0.254: v26.75,28.75 U$1.82
  Bottom 0.254: C11.1 26.5,28.5 v26.75,28.75
VCC  (via drill 0.4)
  Top 0.254: R24.1 42.17,17.62 41,17.62 | 41,17.62 40.38,17.62 34.75,23.25 U$1.64 30.25,23.25 v29.75,23.75 | 41,17.5 41,17.62 | v23.25,28.75 23.5,28.75 24.25,29.5 U$1.87 | U$1.89 v23.25,28.75 | v18.25,18 17,16.75 U$1.25 15,16.75 | v23.25,28.75 23.25,28.25 26.25,25.5 28,23.75 v28,20.5 28,19.5 27,18.5 21.5,18.5 v20.25,17.25 | 18.75,36 18.25,36 18.25,37.27 C20.+ 18.5,37.27 | 15,16.75 13.5,16.75 | 15,16.75 15,14.2 PUSH2.1 PUSH1.1 | LED10.A 16.66,42.13 16.66,42.72 JP3.1 | 17.48,42.75 17.49,42.76 | R2.1 36.64,45.15
  Top 0.406: R23.1 v40.75,20 | v41.25,17.25 41,17.5 | 18.75,36 v18.75,35.25 | 18.5,37.27 18.5,41.75 18.25,42 | 18.25,42 17.49,42.76 | 18.25,42 18.25,48.5 19,49.25 32.54,49.25 JP4.2 | JP3.1 17.48,42.75 | JP1.1 42.2,38.93 41.5,39.62 39.62,39.62 37.88,41.38 37.88,43.5 37.12,44.25 37.12,45.14 R2.1 | 36.64,45.15 JP4.2 | JP4.2 34,47.75
  Bottom 0.254: 41.25,19.5 41.12,19.62 41.12,19.88 | v18.25,18 18.35,18.1 C5.1 C4.2 21.1,18.1 v20.25,17.25 | C24.2 C14.1 28.4,23.75 v29.75,23.75 | v28,20.5 27.75,20.75 27.75,21.75 C24.2 | C24.2 28,21.75
  Bottom 0.406: v40.75,20 41.12,19.62 | 41.25,19.5 v41.25,17.25 | L2.2 21.15,28.25 C3.1 C2.2 23,28.5 v23.25,28.75 23,28.75 18.75,33 v18.75,35.25 | JP1.1 42.75,38.38 42.75,21.5 41.12,19.88
VUSB  (via drill 0.4)
  Top 0.254: v27.75,28.75 27.25,29.25 U$1.81 27.25,32.25 v27,32.5 | D4.1 35.07,31.71 SJ1.2 36.68,31.32 v36.75,31.25
  Bottom 0.254: C12.1 28,28.5 v27.75,28.75 | v27,32.5 30.25,29.25 35.5,29.25 36.75,30.5 v36.75,31.25
VUSBBUS  (via drill 0.4)
  Top 0.254: v29.25,28.75 28.75,29.25 28.25,29.25 27.75,29.75 U$1.80 27.75,34 28.75,35 28.75,36 28.38,36.38 | 28.38,36.38 26.1,38.65 X1.VBUS | R21.1 30.43,38.43 28.38,36.38
  Bottom 0.254: C10.1 29.5,28.5 v29.25,28.75

### Text on the board
tDocu: TX | RX | P6.0 | GND | RST | RST | P9.7 | USB | +3.3V | TEST | A13/P7.5 | A12/P7.4 | Power | P6.1 | P9.6 | Reset | P6.2 | A15/DAC1/P7.7 | A14/DAC0/P7.6 | P9.5 | P6.3 | Power | P9.4 | - | + | P6.4 | XT2 | P9.3 | VREF- | VREF+ | P6.5 | USB | P9.2 | Power | Jumper | P6.6 | P9.1 | P6.7 | Order Number | P9.0 | USB | 49560 | Switch | P2.0 | Bootloader | P8.7 | P2.1 | XT1 | SCL/P8.6 | I2C Pullup | 04/2012 | Res. | P2.2 | SDA/P8.5 | P2.3 | P8.4 | P2.4 | P2.7 | ACLK | SMCLK | P8.3 | P2.5 | P1.0 | P1.1 | P1.2 | P1.3 | P1.4 | P1.5 | P1.6 | P1.7 | P8.2 | P2.6 | P2.6 | KTU-DSPLAB | P8.1 | P2.7 | TB0CLK/P8.0 | P3.0 | P3.1 | P3.2 | P3.3 | P3.4 | P4.3 | P4.4 | P4.5 | P4.6 | P4.7
bDocu: GND | GND | TX | RX | P7.7 | P7.6 | P7.5 | P7.4 | GND | RST | TEST | CB0/A0 | 3.3V | +3.3V | P9.7 | Spy Bi-Wire | P9.6 | CB1/A1 | P9.5 | CB2/A2 | KTU-DSPLAB | P9.4 | CB3/A3 | P9.3 | CB4/A4 | P9.2 | CB5/A5 | MSP430 | Experimenter Board | P9.1 | CB6/DAC0/A6 | P9.0 | CB7/DAC1/A7 | P2.0 | UCB1SOMI | P2.1 | XT1 | UCB1SCL | UCB1SIMO | UCB1SDA | P2.2 | UCB1CLK | P2.3 | UCA1STE | UCA1RXD | UCA1SOMI | P2.4 | UCA1TXD | P2.5 | UCA1SIMO | UCA1CLK | P2.6 | UCB1STE | P2.7 | TB0CLK | TA4.7 | P3.0/TA1CLK | P3.1/TA1.0 | P3.2/TA1.1 | P3.3/TA1.2 | P3.4/TA2CLK/SMCLK | P3.5/TA2.0 | P3.6/TA2.1 | P3.7/TA2.2 | P4.0/TB0.0 | P4.1/TB0.1 | P4.2/TB0.2 | P4.3/TB0.3 | P4.4/TB0.4 | P4.5/TB0.5 | P4.6/TB0.6